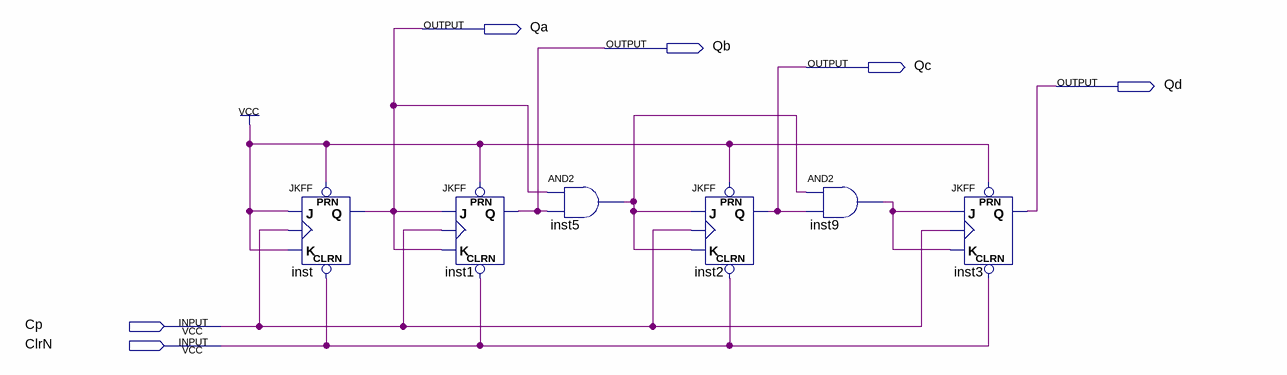
[diagram p0: schematic sheet]
// Quartus schematic 4bits_counter.bdf as structural Verilog: 6 symbols, 6 pins
module \4bits_counter  (
  input  Cp,
  input  ClrN,
  output Qa,
  output Qb,
  output Qc,
  output Qd
);

  wire inst5_out, inst9_out;

  JKFF inst (.PRN(1'b1), .CLRN(ClrN), .K(1'b1), .J(1'b1), .CLK(Cp), .Q(Qa));
  JKFF inst1 (.PRN(1'b1), .CLRN(ClrN), .K(Qa), .J(Qa), .CLK(Cp), .Q(Qb));
  and inst5 (inst5_out, Qa, Qb);
  JKFF inst2 (.PRN(1'b1), .CLRN(ClrN), .K(inst5_out), .J(inst5_out), .CLK(Cp), .Q(Qc));
  and inst9 (inst9_out, inst5_out, Qc);
  JKFF inst3 (.PRN(1'b1), .CLRN(ClrN), .K(inst9_out), .J(inst9_out), .CLK(Cp), .Q(Qd));
endmodule
